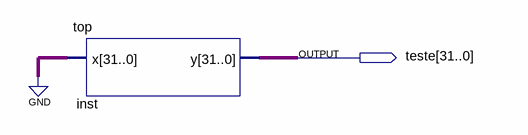
[diagram p0: schematic sheet]
// Quartus schematic top_test.bdf as structural Verilog: 1 symbols, 1 pins
module top_test (
  output [31:0] teste
);

  top inst (.x({32{1'b0}}), .y(teste));
endmodule
